# EAGLE design CSS811_BME280_Breakout (EAGLE 7.7.0)
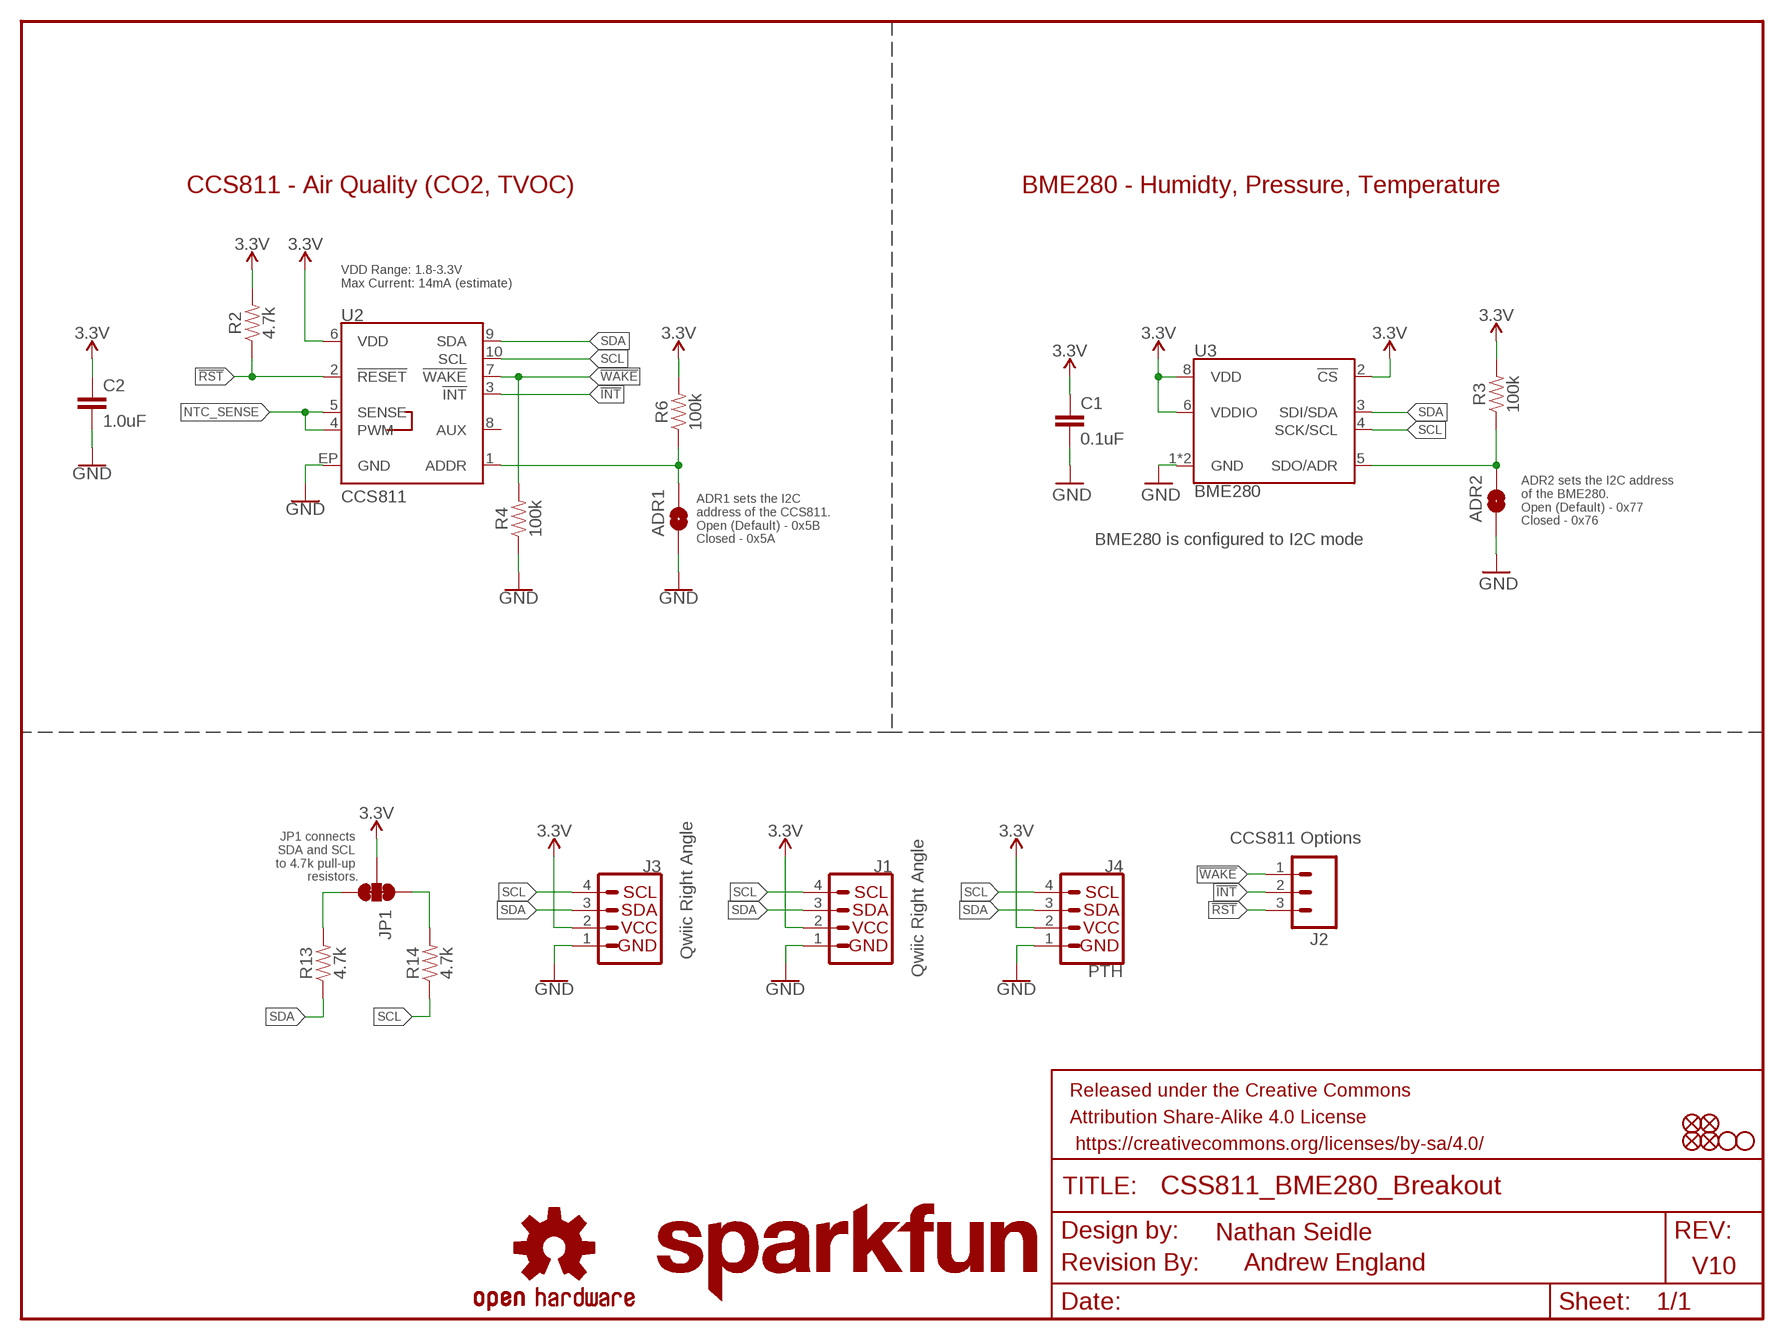
[diagram p0: schematic, sheet 1]

## Parts
ADR1  JUMPER-SMT_2_NO_SILK  [SMT-JUMPER_2_NO_SILK]
ADR2  JUMPER-SMT_2_NO_SILK  [SMT-JUMPER_2_NO_SILK]
C1  0.1uF  0.1UF-0603-25V-(+80/-20%)  [0603]
C2  1.0uF  1.0UF-0603-16V-10%  [0603]
FD1  FIDUCIAL1X2  [FIDUCIAL-1X2]
FD2  FIDUCIAL1X2  [FIDUCIAL-1X2]
FD3  FIDUCIAL1X2  [FIDUCIAL-1X2]
FD4  FIDUCIAL1X2  [FIDUCIAL-1X2]
FRAME1  FRAME-LETTER  [CREATIVE_COMMONS]
H2  STAND-OFF  [STAND-OFF]
H4  STAND-OFF  [STAND-OFF]
J1  Qwiic Right Angle  I2C_STANDARDQWIIC  [1X04_1MM_RA]
J2  CCS811 Options  CONN_031X03_NO_SILK  [1X03_NO_SILK]
J3  Qwiic Right Angle  I2C_STANDARDQWIIC  [1X04_1MM_RA]
J4  PTH  I2C_STANDARD_NO_SILK  [1X04_NO_SILK]
JP1  JUMPER-SMT_3_2-NC_TRACE_SILK  [SMT-JUMPER_3_2-NC_TRACE_SILK]
LOGO1  SFE_LOGO_NAME.1_INCH  [SFE_LOGO_NAME_.1]
LOGO2  REVISION  [REVISION]
LOGO4  OSHW-LOGOS  [OSHW-LOGO-S]
R2  4.7k  4.7KOHM-0603-1/10W-1%  [0603]
R3  100k  100KOHM-0603-1/10W-1%  [0603]
R4  100k  100KOHM-0603-1/10W-1%  [0603]
R6  100k  100KOHM-0603-1/10W-1%  [0603]
R13  4.7k  4.7KOHM-0603-1/10W-1%  [0603]
R14  4.7k  4.7KOHM-0603-1/10W-1%  [0603]
U2  CCS811  CCS811PRODUCTION  [LGA10]
U3  BME280  [LGA-8-2.5X2.5]

## Nets
3.3V: C1.1 C2.1 J1.2 J3.2 J4.2(VCC) JP1.2 R2.2 R3.2 R6.2 U2.6(VDD) U3.2(!CS) U3.6(VDDIO) U3.8(VDD)
!INT: J2.2 U2.3(!INT!)
!RST: J2.3 R2.1 U2.2(!RESET!)
!WAKE: J2.1 R4.2 U2.7(!WAKE!)
CCS811_ADDR: ADR1.2 R6.1 U2.1(ADDR)
GND: ADR1.1 ADR2.1 C1.2 C2.2 J1.1 J3.1 J4.1(GND) R4.1 U2.EP(GND) U3.1(GND) U3.7(GND)
N$4: JP1.3 R13.2
N$5: JP1.1 R14.2
NTC_SENSE: U2.4(PWM) U2.5(SENSE)
SCL: J1.4 J3.4 J4.4(SCL) R14.1 U2.10(SCL) U3.4(SCK/SCL)
SDA: J1.3 J3.3 J4.3(SDA) R13.1 U2.9(SDA) U3.3(SDI/SDA)
SDO/ADR: ADR2.2 R3.1 U3.5(SDO/ADR)
Unconnected: U2.8(AUX)

## Notes on the sheet
- CCS811 - Air Quality (CO2, TVOC) | BME280 - Humidty, Pressure, Temperature
- VDD Range: 1.8-3.3V
  Max Current: 14mA (estimate)
- ADR2 sets the I2C address
  of the BME280.
  Open (Default) - 0x77
  Closed - 0x76
- ADR1 sets the I2C 
  address of the CCS811.
  Open (Default) - 0x5B
  Closed - 0x5A
- BME280 is configured to I2C mode
- JP1 connects 
  SDA and SCL 
  to 4.7k pull-up 
  resistors.
- Nathan Seidle
- Andrew England | V10

## Library data of the parts
ADR1 ADR2 = SparkFun-Jumpers:JUMPER-SMT_2_NO: Normally open jumper This jumper has two pads in close proximity to each other. Apply solder to close the connection. Round pads are easier to solder for beginners, but are a lot larger. SparkFun Product that uses the round pads: SparkFun EL Sequencer <https://www.sparkfun.com/products/12781>
C1 = SparkFun-Capacitors:0.1UF: 0.1µF ceramic capacitors A capacitor is a passive two-terminal electrical component used to store electrical energy temporarily in an electric field.; PROD_ID: CAP-00810
C2 = SparkFun-Capacitors:1.0UF: 1µF ceramic capacitors A capacitor is a passive two-terminal electrical component used to store electrical energy temporarily in an electric field.; PROD_ID: CAP-00868
FD1-FD4 = SparkFun-Aesthetics:FIDUCIAL: Fiducial Alignment Points Point-of-reference for pick-and-place machines and other optical instruments.
FRAME1 = SparkFun-Aesthetics:FRAME-LETTER: Schematic Frame - Letter Standard 8.5x11 US Letter frame
H2 H4 = SparkFun-Hardware:STAND-OFF: Stand Off Drill holes for mechanically mounting via screws, standoffs, etc. Note: Use the keepout ring to avoid running the screw head into surrounding components. Variant Overviews STAND-OFF - Mechanical footprint for a #4 phillips button head screw. STAND-OFF-TIGHT - Mechanical footprint for a #4 phillips button head screw, Example SparkFun Products Screw - Phillips Head (1/4", 4-40, 10 pack) <https://www.sparkfun.com/products/10453> (PRT-10453) Screw - Phillips Head (1/2", 4-40, 10 pack) <https://www.sparkfun.com/products/10452> (PRT-10452) Screw - Phillips Head (3/4", 4-40, 10 pack) <https://www.sparkfun.com/products/10451> (PRT-10451) Screw - Phillips Head (1", 4-40, 10 pack) <https://www.sparkfun.com/products/10450> (PRT-10450)
J1 J3 = SparkFun-Connectors:I2C_STANDARD: SparkFun I2C Standard Pinout Header SparkFun has standardized on a pinout for all I2C based sensor breakouts. This pinout allows I2C boards to be plugged directly into the headers on Arduino Uno compatible boards, and to be daisy chained easily. Example SparkFun Products: SparkFun Atmospheric Sensor Breakout - BME280 <https://www.sparkfun.com/products/13676> SparkFun Altitude/Pressure Sensor Breakout - MPL3115A2 <https://www.sparkfun.com/products/11084> SparkFun TOF Range Finder Sensor - VL6180 <https://www.sparkfun.com/products/12785>; PROD_ID: CONN-13729
J2 = SparkFun-Connectors:CONN_03: Multi connection point. Often used as Generic Header-pin footprint for 0.1 inch spaced/style header connections On any of the 0.1 inch spaced packages, you can populate with these: Break Away Headers - Straight <https://www.sparkfun.com/products/116> (PRT-00116) Break Away Male Headers - Right Angle <https://www.sparkfun.com/products/553> (PRT-00553) Female Headers <https://www.sparkfun.com/products/115> (PRT-00115) Break Away Headers - Machine Pin <https://www.sparkfun.com/products/117> (PRT-00117) Break Away Female Headers - Swiss Machine Pin <https://www.sparkfun.com/products/743> (PRT-00743) Stackable Header - 3 Pin (Female, 0.1") <https://www.sparkfun.com/products/13875> (PRT-13875) For SCREWTERMINALS and SPRING TERMINALS visit here: Screw Terimnals on SparkFun.com <https://www.sparkfun.com/search/results?term=Screw+Terminals> (5mm/3.5mm/2.54mm spacing) This device is also useful as a general connection point to wire up your design to another part of your project. Our various solder wires solder well into these plated through hole pads. Hook-Up Wire - Assortment (Stranded, 22 AWG) <https://www.sparkfun.com/products/11375> (PRT-11375) Hook-Up Wire - Assortment (Solid Core, 22 AWG) <https://www.sparkfun.com/products/11367> (PRT-11367) View the entire wire category on our website here <https://www.sparkfun.com/categories/141> Special notes: Molex polarized connector foot print use with SKU : PRT-08232 with associated crimp pins and housings.
J4 = SparkX:I2C_STANDARD: SparkFun I2C Standard Pinout Header SparkFun has standardized on a pinout for all I2C based sensor breakouts. This pinout allows I2C boards to be plugged directly into the headers on Arduino Uno compatible boards, and to be daisy chained easily. Example SparkFun Products: SparkFun Atmospheric Sensor Breakout - BME280 <https://www.sparkfun.com/products/13676> SparkFun Altitude/Pressure Sensor Breakout - MPL3115A2 <https://www.sparkfun.com/products/11084> SparkFun TOF Range Finder Sensor - VL6180 <https://www.sparkfun.com/products/12785>
JP1 = SparkFun-Jumpers:JUMPER-SMT_3_2-NC_TRACE: Normally closed trace jumper (2 of 2 connections) This jumper has a trace between all three pads so they are normally closed (NC). Use a razor knife to open the connection(s). For best results follow the IPC guidelines for cutting traces: Cutout at least 0.063 mm (0.005 in). Remove all loose material to clean up the cut area. Seal the cut with an approved epoxy. Reapply solder to reclose the connection(s).
LOGO1 = SparkFun-Aesthetics:SFE_LOGO_NAME: SparkFun Font Logo This is the SparkFun name logo. The logo on the schematic will always be the same size; the package variant is the height of the flame part of the logo (or the height the flame would be, if it were drawn). Default layer for the logo on the board is tSilk.
LOGO2 = SparkFun-Aesthetics:REVISION: "Revision By" Text Preceding text for revisor documentation. Includes schematic text on "symbols" layer, and board text on tDoc.
LOGO4 = SparkFun-Aesthetics:OSHW-LOGO: Open-Source Hardware (OSHW) Logo This logo indicates the piece of hardware it is found on incorporates a OSHW license and/or adheres to the definition of open source hardware found here: http://freedomdefined.org/OSHW
R2 R13 R14 = SparkFun-Resistors:4.7KOHM: 4.7kΩ resistor A resistor is a passive two-terminal electrical component that implements electrical resistance as a circuit element. Resistors act to reduce current flow, and, at the same time, act to lower voltage levels within circuits. - Wikipedia; PROD_ID: RES-07857
R3 R4 R6 = SparkFun-Resistors:100KOHM: 100kΩ resistor A resistor is a passive two-terminal electrical component that implements electrical resistance as a circuit element. Resistors act to reduce current flow, and, at the same time, act to lower voltage levels within circuits. - Wikipedia; PROD_ID: RES-07828
U2 = SparkFun-Sensors:CCS811: AMS CCS811 – I2C Digital Gas Sensor Ultra-Low Power Digital Gas Sensor for Monitoring Indoor Air Quality AMS Product Page <http://ams.com/eng/Products/Environmental-Sensors/Gas-Sensors/CCS811> SparkFun Products:; PROD_ID: IC-13607
U3 = SparkFun-Sensors:BME280: Bosch BME280 – Combined Humidity and Pressure Sensor The BME280 is as combined digital humidity, pressure and temperature sensor based on proven sensing principles. The sensor module is housed in an extremely compact metal-lid LGA package with a footprint of only 2.5×2.5mm² with a height of 0.93mm. Its small dimensions and its low power consumption allow the implementation in battery driven devices such as handsets, GPS modules or watches. Datasheet <https://cdn.sparkfun.com/assets/learn_tutorials/4/1/9/BST-BME280_DS001-10.pdf> SparkFun Products SparkFun Atmospheric Sensor Breakout - BME280 <https://www.sparkfun.com/products/13676> (SEN-13676); PROD_ID: IC-13090

## Board
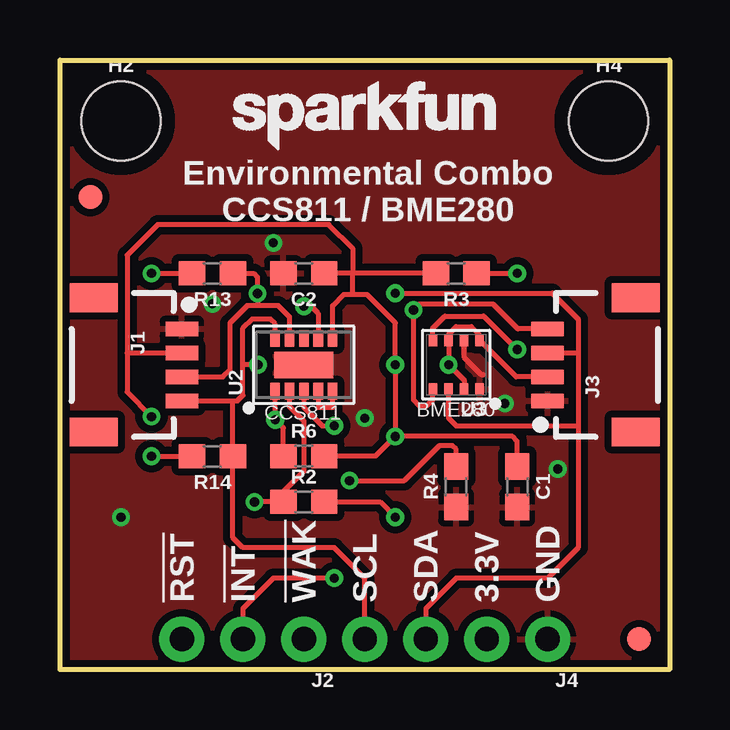
[diagram p1: board, top side]
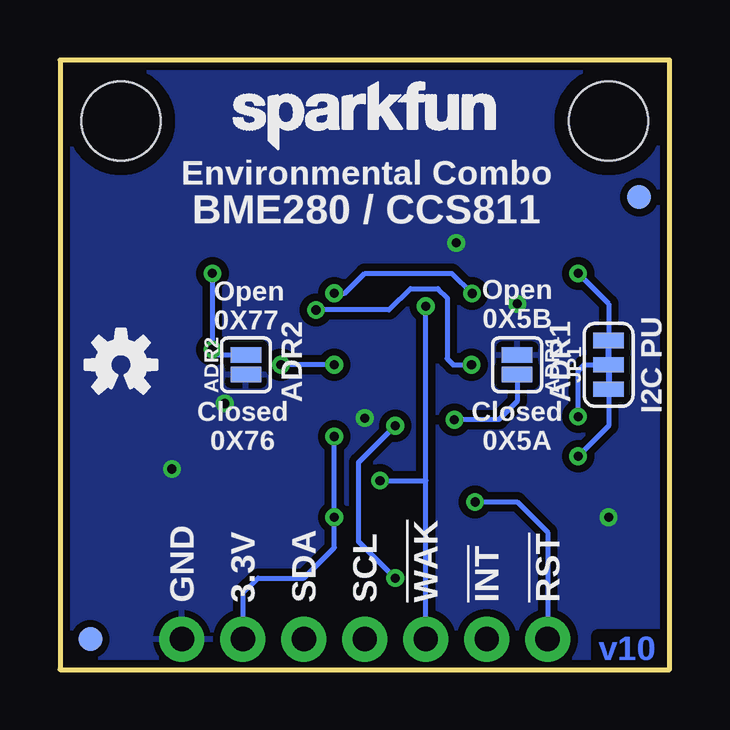
[diagram p2: board, bottom side, seen from below]

Size 25.4 x 25.4 mm. Coordinates in mm from the lower left corner, seen from the top.
Outline: 0,0 0,25.4 25.4,25.4 25.4,0 0,0
Copper layers (1*16): Top 0.035mm / dielectric 1.5mm / Bottom 0.035mm
Design rules "SparkFun-2-layer-TIGHT": minimum track width 7mil, minimum drill 15mil, track to track 7mil, track to pad 7mil, pad to pad 7mil, via to via 7mil, smd to smd 7mil, copper to edge 7mil, drill to drill 7mil, minimum pad ring 7mil, minimum via ring 7mil, stop-mask expansion 4mil, vias tented up to drill 25mil, thermal gap 10mil

### Footprints (pad centres in the part's own frame; a part is rotated, then mirrored left to right if it is on the bottom)
SMT-JUMPER_2_NO_SILK = smd 0.635 x 1.27: 1 -0.406,0; 2 0.406,0
0603 = smd 1.1 x 1: 1 -0.85,0; 2 0.85,0
FIDUCIAL-1X2 = smd 1 x 1: 1 0,0
STAND-OFF = hole 3.302: 0,0
1X04_1MM_RA = smd 0.6 x 1.35: 1 -1.5,0; 2 -0.5,0; 3 0.5,0; 4 1.5,0 | smd 1.2 x 2: NC1 2.8,-3.675; NC2 -2.8,-3.675
1X03_NO_SILK = drill 1.016 pad 1.88: 1 0,0; 2 2.54,0; 3 5.08,0
1X04_NO_SILK = drill 1.016 pad 1.88: 1 0,0; 2 2.54,0; 3 5.08,0; 4 7.62,0
SMT-JUMPER_3_2-NC_TRACE_SILK = smd 0.635 x 1.27: 1 -1.016,0; 2 0,0; 3 1.016,0
LGA10 = smd 0.7 x 0.4: 1 -1.1,1.2; 2 -1.1,0.6; 3 -1.1,0; 4 -1.1,-0.6; 5 -1.1,-1.2; 6 1.1,-1.2; 7 1.1,-0.6; 8 1.1,0; 9 1.1,0.6; 10 1.1,1.2 | smd 1.1 x 2.45: EP 0,0
LGA-8-2.5X2.5 = smd 0.35 x 0.5: 1 -0.975,1.025; 2 -0.325,1.025; 3 0.325,1.025; 4 0.975,1.025; 5 0.975,-1.025; 6 0.325,-1.025; 7 -0.325,-1.025; 8 -0.975,-1.025

### Placement (x,y rotation side)
ADR1  6.35,12.7 270 bottom
ADR2  17.65,12.7 90 bottom
C1  19.05,7.62 270 top
C2  10.16,16.51 180 top
FD1  1.27,19.68 0 top
FD2  24.13,1.27 0 top
FD3  24.13,1.27 0 bottom
FD4  1.27,19.68 0 bottom
FRAME1  -13.97,-21.59 0 top  (outside the outline)
H2  2.54,22.86 0 top
H4  22.86,22.86 0 top
J1  5.08,12.7 270 top
J2  10.16,1.27 180 top
J3  20.32,12.7 90 top
J4  20.32,1.27 180 top
JP1  2.54,12.7 90 bottom
LOGO1  6.73,21.18 0 top
LOGO2  -2.54,-24.13 0 top  (outside the outline)
LOGO3  SFE_LOGO_NAME.1_INCH  [SFE_LOGO_NAME_.1]  18.67,21.18 0 bottom
LOGO4  22.86,12.7 0 bottom
R2  10.16,6.99 0 top
R3  16.51,16.51 180 top
R4  16.51,7.62 90 top
R6  10.16,8.89 0 top
R13  6.35,16.51 180 top
R14  6.35,8.89 180 top
U2  10.16,12.7 90 top
U3  16.51,12.7 180 top

### Tracks (layer width: path | path; a pad name or v marks a point on that pad's centre or on a via)
3.3V  (via drill 0.38)
  Top 0.203: 2.79,13.2 J1.2 | R3.2 12.22,16.51 | 12.22,16.51 12.13,16.51 | 12.13,16.51 C2.1 | 2.79,13.2 2.79,17.27 4.06,18.54 11.21,18.54 12.19,17.56 12.19,16.54 12.22,16.51 | R2.2 13.34,6.99 v13.97,6.35 | 2.79,13.2 2.79,11.56 v3.81,10.54 | J3.2 19.01,12.2 U3.8 17.48,13.95 17.14,14.29 16.51,14.29 16.19,13.97 16.19,13.73 U3.6 v16.19,12.7 16.84,12.06 U3.2 16.83,11.68 | v13.97,9.72 v13.97,12.7 13.97,14.45 12.79,15.62 12.19,15.62 | R6.2 13.14,8.89 v13.97,9.72 | C1.1 19.05,9.53 18.86,9.72 v13.97,9.72 | U2.6 11.36,15.17 11.81,15.62 12.19,15.62 | 12.19,15.62 12.19,16.45 12.13,16.51
  Bottom 0.203: v13.97,9.72 v13.97,6.35 13.97,5.08 15.24,3.81 17.14,3.81 17.78,3.17 J4.2 | v3.81,10.54 3.81,12.45 3.56,12.7 JP1.2 | v13.97,12.7 v16.19,12.7
!INT  (via drill 0.38)
  Top 0.203: J2.2 7.62,2.54 8.89,3.81 v11.43,3.81 | U2.3 10.16,10.92 10.92,10.16 v11.43,10.16
  Bottom 0.203: v11.43,3.81 12.95,5.33 12.95,8.64 v11.43,10.16
!RST  (via drill 0.38)
  Top 0.203: U2.2 9.56,10.96 10.16,10.36 10.16,8.26 9.31,7.41 R2.1 v8.1,6.99
  Bottom 0.203: J2.3 5.08,5.71 6.35,6.99 v8.1,6.99
!WAKE  (via drill 0.38)
  Top 0.203: 10.41,15.14 v10.16,15.14 10.46,15.14 10.76,14.84 U2.7 | v12.06,7.87 14.35,7.87 15.81,9.34 16.35,9.34 16.51,9.18 R4.2
  Bottom 0.203: J2.1 10.16,7.87 | 10.16,7.87 v10.16,15.14 | v12.06,7.87 10.16,7.87
CCS811_ADDR  (via drill 0.38)
  Top 0.203: R6.1 9.31,10.07 v8.97,10.41 v8.96,10.42 U2.1
  Bottom 0.203: ADR1.2 6.35,11.18 7.11,10.41 v8.97,10.41
GND  (via drill 0.38)
  Top 0.203: U3.7 16.83,13.72 16.83,13.02 17.55,12.29 ADR2.1
  other vias: 2.54,6.35 12.7,10.48 6.35,15.24 8.89,17.78 20.74,8.36 18.54,11.09
  pour Top (isolate 0.305): 0,0 25.4,0 25.4,25.4 0,25.4
  pour Bottom (isolate 0.305): 0,25.4 25.4,25.4 25.4,0 0,0
N$4  (via drill 0.38)
  Top 0.203: v3.81,16.51 R13.2
  Bottom 0.203: v3.81,16.51 2.54,15.24 JP1.3
N$5  (via drill 0.38)
  Top 0.203: v3.81,8.89 R14.2
  Bottom 0.203: JP1.1 2.54,10.16 v3.81,8.89
NTC_SENSE
  Top 0.203: U2.4 10.76,10.92 11.37,10.92 U2.5
SCL  (via drill 0.38)
  Top 0.203: J1.4 7.2,11.2 | 7.62,12.7 7.62,11.43 7.39,11.2 7.2,11.2 | 7.62,12.7 7.62,14.22 8,14.61 8.76,14.61 8.96,14.41 U2.10 | 7.2,11.2 R14.1 7.2,5.5 7.62,5.08 11.43,5.08 12.7,3.81 J4.4 | J3.4 19.07,14.2 18.03,15.24 14.99,15.24 v14.73,14.99 14.73,11.24 15,10.97 15.26,10.97 15.54,11.25 U3.4 | v8.26,12.7 7.62,12.7
  Bottom 0.203: v8.26,12.7 9.02,12.7 9.27,12.95 9.27,15.49 9.65,15.88 10.79,15.88 11.68,14.99 v14.73,14.99
SDA  (via drill 0.38)
  Top 0.203: J1.3 6.79,12.2 7.07,12.48 7.07,14.44 7.8,15.16 8.23,15.16 | U2.9 9.56,14.71 9.1,15.16 8.23,15.16 | 8.23,15.16 v8.23,15.67 v8.22,15.68 8.22,16.35 8.06,16.51 R13.1 | 21.59,13.21 21.59,14.61 20.51,15.68 v13.97,15.68 | 21.59,13.21 21.59,10.16 | 21.59,10.16 21.59,5.08 20.32,3.81 16.51,3.81 15.24,2.54 J4.3 | J3.3 21.58,13.2 21.59,13.21 | U3.3 16.18,10.48 16.51,10.16 21.59,10.16
  Bottom 0.203: v8.23,15.67 9.07,16.51 12.7,16.51 13.53,15.68 v13.97,15.68
SDO/ADR  (via drill 0.38)
  Top 0.203: R3.1 v19.05,16.51 | U3.5 15.54,14.23 16.03,14.73 17.65,14.73 v19.05,13.34
  Bottom 0.203: v19.05,16.51 v19.05,13.34 18.83,13.11 ADR2.2

### Text on the board
Bottom: v10
tPlace: Environmental Combo | CCS811 / BME280 | !RST | !INT | !WAK | SCL | SDA | 3.3V | GND
bPlace: Environmental Combo | BME280 / CCS811 | Open / 0X5B | Open / 0X77 | I2C PU | ADR1 | ADR2 | Closed / 0X5A | Closed / 0X76 | !RST | !INT | !WAK | SCL | SDA | 3.3V | GND
tNames: BME280 | CCS811
Measures: Measurements in mm
tDocu: Nathan Seidle | Andrew England